# EasyEDA Pro project ProProject_电源电路完整20240517_2024-08-10.epro

# Schematic Schematic24
Create Date: 2024-04-10; Page Name: P1; Project Name: P22; Schematic Name: Schematic24; Update Date: 2024-04-10; Company: 嘉立创EDA; Page Size: A4; Version: V1.0
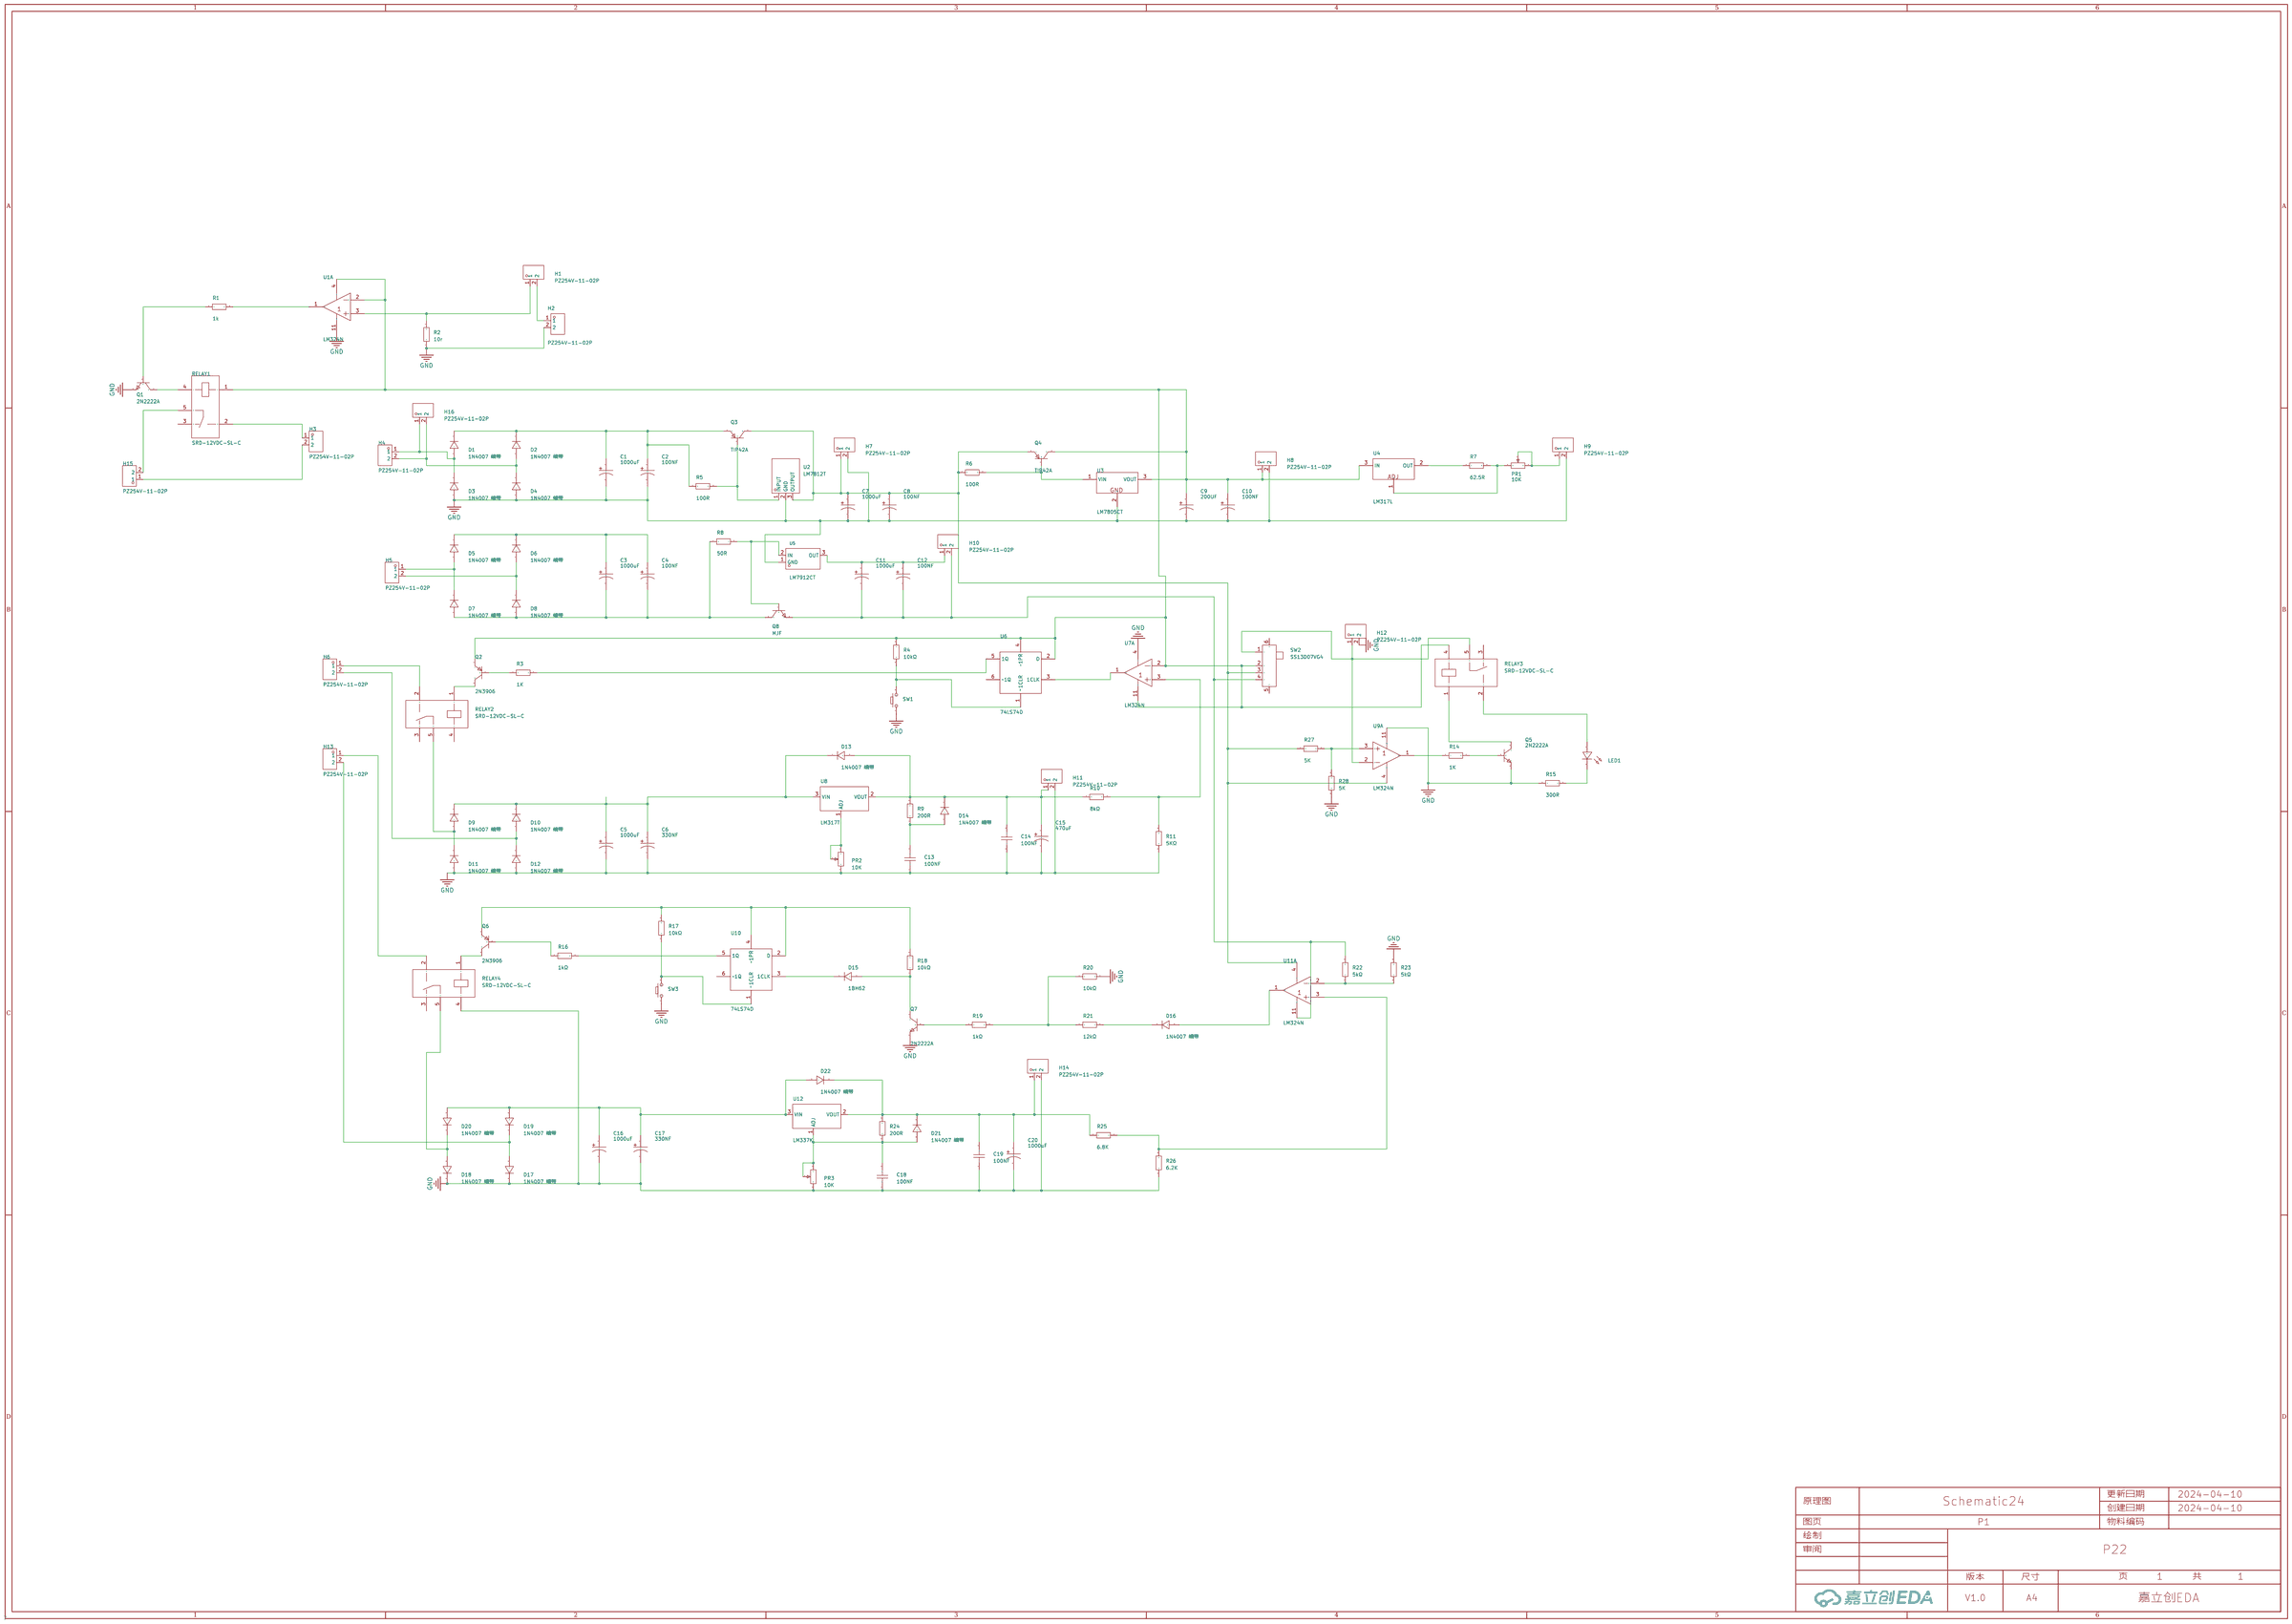
[diagram p0: schematic sheet]

## Parts
C1  1000uF  [CAP-TH_BD12.5-P5.00-D0.6-FD]
C2  100NF  [CAP-TH_BD12.5-P5.00-D0.6-FD]
C3  1000uF  [CAP-TH_BD12.5-P5.00-D0.6-FD]
C4  1000uF  [CAP-TH_BD12.5-P5.00-D0.6-FD]
C5  1000uF  [CAP-TH_BD12.5-P5.00-D0.6-FD]
C6  330NF  [CAP-TH_BD12.5-P5.00-D0.6-FD]
C7  1000uF  [CAP-TH_BD12.5-P5.00-D0.6-FD]
C8  100NF  [CAP-TH_BD12.5-P5.00-D0.6-FD]
C9  200UF  [CAP-TH_BD12.5-P5.00-D0.6-FD]
C10  100NF  [CAP-TH_BD12.5-P5.00-D0.6-FD]
C11  1000uF  [CAP-TH_BD12.5-P5.00-D0.6-FD]
C12  100NF  [CAP-TH_BD12.5-P5.00-D0.6-FD]
C13  100NF  [CAP-TH_L5.5-W4.0-P5.00-D0.5]
C14  100NF  [CAP-TH_L5.5-W4.0-P5.00-D0.5]
C15  470uF  [CAP-TH_BD12.5-P5.00-D0.6-FD]
C16  1000uF  [CAP-TH_BD12.5-P5.00-D0.6-FD]
C17  330NF  [CAP-TH_BD12.5-P5.00-D0.6-FD]
C18  100NF  [CAP-TH_L5.5-W4.0-P5.00-D0.5]
C19  100NF  [CAP-TH_L5.5-W4.0-P5.00-D0.5]
C20  1000uF  [CAP-TH_BD12.5-P5.00-D0.6-FD]
D1  1N4007 编带  [DO-41_BD2.4-L4.7-P8.70-D0.9-RD]
D2  1N4007 编带  [DO-41_BD2.4-L4.7-P8.70-D0.9-RD]
D3  1N4007 编带  [DO-41_BD2.4-L4.7-P8.70-D0.9-RD]
D4  1N4007 编带  [DO-41_BD2.4-L4.7-P8.70-D0.9-RD]
D5  1N4007 编带  [DO-41_BD2.4-L4.7-P8.70-D0.9-RD]
D6  1N4007 编带  [DO-41_BD2.4-L4.7-P8.70-D0.9-RD]
D7  1N4007 编带  [DO-41_BD2.4-L4.7-P8.70-D0.9-RD]
D8  1N4007 编带  [DO-41_BD2.4-L4.7-P8.70-D0.9-RD]
D9  1N4007 编带  [DO-41_BD2.4-L4.7-P8.70-D0.9-RD]
D10  1N4007 编带  [DO-41_BD2.4-L4.7-P8.70-D0.9-RD]
D11  1N4007 编带  [DO-41_BD2.4-L4.7-P8.70-D0.9-RD]
D12  1N4007 编带  [DO-41_BD2.4-L4.7-P8.70-D0.9-RD]
D13  1N4007 编带  [DO-41_BD2.4-L4.7-P8.70-D0.9-RD]
D14  1N4007 编带  [DO-41_BD2.4-L4.7-P8.70-D0.9-RD]
D15  1BH62  [DO-41_BD2.4-L4.7-P8.70-D0.9-RD]
D16  1N4007 编带  [DO-41_BD2.4-L4.7-P8.70-D0.9-RD]
D17  1N4007 编带  [DO-41_BD2.4-L4.7-P8.70-D0.9-RD]
D18  1N4007 编带  [DO-41_BD2.4-L4.7-P8.70-D0.9-RD]
D19  1N4007 编带  [DO-41_BD2.4-L4.7-P8.70-D0.9-RD]
D20  1N4007 编带  [DO-41_BD2.4-L4.7-P8.70-D0.9-RD]
D21  1N4007 编带  [DO-41_BD2.4-L4.7-P8.70-D0.9-RD]
D22  1N4007 编带  [DO-41_BD2.4-L4.7-P8.70-D0.9-RD]
H1  PZ254V-11-02P  [HDR-TH_2P-P2.54-V-M]
H2  PZ254V-11-02P  [HDR-TH_2P-P2.54-V-M]
H3  PZ254V-11-02P  [HDR-TH_2P-P2.54-V-M]
H4  PZ254V-11-02P  [HDR-TH_2P-P2.54-V-M]
H5  PZ254V-11-02P  [HDR-TH_2P-P2.54-V-M]
H6  PZ254V-11-02P  [HDR-TH_2P-P2.54-V-M]
H7  PZ254V-11-02P  [HDR-TH_2P-P2.54-V-M]
H8  PZ254V-11-02P  [HDR-TH_2P-P2.54-V-M]
H9  PZ254V-11-02P  [HDR-TH_2P-P2.54-V-M]
H10  PZ254V-11-02P  [HDR-TH_2P-P2.54-V-M]
H11  PZ254V-11-02P  [HDR-TH_2P-P2.54-V-M]
H12  PZ254V-11-02P  [HDR-TH_2P-P2.54-V-M]
H13  PZ254V-11-02P  [HDR-TH_2P-P2.54-V-M]
H14  PZ254V-11-02P  [HDR-TH_2P-P2.54-V-M]
H15  PZ254V-11-02P  [HDR-TH_2P-P2.54-V-M]
H16  PZ254V-11-02P  [HDR-TH_2P-P2.54-V-M]
LED1  -  [LED_TH-3mm]
PR1  10K  [R_3386P]
PR2  10K  [R_3386P]
PR3  10K  [R_3386P]
Q1  2N2222A  [TO-92-3_L4.8-W3.7-P2.54-R]
Q2  2N3906  [TO-92-3_L4.9-W3.7-P1.27-L]
Q3  TIP42A  [TO-220-3_L10.2-W4.5-P2.54-L]
Q4  TIP42A  [TO-220-3_L10.2-W4.5-P2.54-L]
Q5  2N2222A  [TO-92-3_L4.8-W3.7-P2.54-R]
Q6  2N3906  [TO-92-3_L4.9-W3.7-P1.27-L]
Q7  2N2222A  [TO-92-3_L4.8-W3.7-P2.54-R]
Q8  MJF  [TO-92-3_L4.8-W3.7-P2.54-R]
R1  1k  [Res_1/8W]
R2  10r  [Res_1/8W]
R3  1K  [Res_1/8W]
R4  10kΩ  [Res_1/8W]
R5  100R  [Res_1/8W]
R6  100R  [Res_1/8W]
R7  62.5R  [Res_1/8W]
R8  50R  [Res_1/8W]
R9  200R  [Res_1/8W]
R10  8kΩ  [Res_1/8W]
R11  5KΩ  [Res_1/8W]
R14  1K  [Res_1/8W]
R15  300R  [Res_1/8W]
R16  1kΩ  [Res_1/8W]
R17  10kΩ  [Res_1/8W]
R18  10kΩ  [Res_1/8W]
R19  1kΩ  [Res_1/8W]
R20  10kΩ  [Res_1/8W]
R21  12kΩ  [Res_1/8W]
R22  5kΩ  [Res_1/8W]
R23  5kΩ  [Res_1/8W]
R24  200R  [Res_1/8W]
R25  6.8K  [Res_1/8W]
R26  6.2K  [Res_1/8W]
R27  5K  [Res_1/8W]
R28  5K  [Res_1/8W]
RELAY1  SRD-12VDC-SL-C  [RELAY-TH_SRD-XXVDC-XL-C]
RELAY2  SRD-12VDC-SL-C  [RELAY-TH_SRD-XXVDC-XL-C]
RELAY3  SRD-12VDC-SL-C  [RELAY-TH_SRD-XXVDC-XL-C]
RELAY4  SRD-12VDC-SL-C  [RELAY-TH_SRD-XXVDC-XL-C]
SW1  -  [Key_TH_3.5x6x4.3]
SW2  SS13D07VG4  [SW-TH_SS13D07VG4]
SW3  -  [Key_TH_3.5x6x4.3]
U1  LM324N  [DIP-14_L19.4-W6.4-P2.54-LS7.6-BL]  (section 1)
U2  LM7812T  [TO-220-3_L10.0-W4.5-P2.54-L]
U3  LM7805CT  [TO-220-3_L10.2-W4.6-P2.54-L]
U4  LM317L  [TO-92-3_L4.9-W3.7-P1.27-L]
U5  LM7912CT  [TO-220-3_L10.0-W4.6-P2.54-L]
U6  74LS74D  [74LS74]
U7  LM324N  [DIP-14_L19.4-W6.4-P2.54-LS7.6-BL]  (section 1)
U8  LM317T  [TO-220-3_L10.0-W4.6-P2.54-L]
U9  LM324N  [DIP-14_L19.4-W6.4-P2.54-LS7.6-BL]  (section 1)
U10  74LS74D  [74LS74]
U11  LM324N  [DIP-14_L19.4-W6.4-P2.54-LS7.6-BL]  (section 1)
U12  LM337K  [TO-220-3_L10.0-W4.6-P2.54-L]

## Library data of the parts
C1-C12 C15-C17 C20 = ECLJ1321102M035P00: 容值:1000uF;精度:±20%;额定电压:35V;; LCSC Part Name: 1000uF ±20% 35V; Supplier Part: C156894; Manufacturer: TOPAZ(黄宝石); Supplier Footprint: 插件; JLCPCB Part Class: 扩展库; Datasheet: https://atta.szlcsc.com/upload/public/pdf/source/20200529/C156894_EF4CA6A97A577F5C9E78FC7D4823CADE.pdf; Supplier: LCSC; Tolerance: ±20%; Rated Voltage: 35V; Lead Spacing: 5mm; Lifetime @ Temp: 10000hrs@105℃
C13 C14 C18 C19 = Y5P102K2KV16CC0224: 容值:1nF;精度:±10%;额定电压:2kV;温度系数:SL;; LCSC Part Name: 1nF ±10% 2kV; Supplier Part: C2887266; Manufacturer: KNSCHA(科尼盛); Supplier Footprint: 插件,P=5mm; JLCPCB Part Class: 扩展库; Datasheet: https://atta.szlcsc.com/upload/public/pdf/source/20210824/9DB7111BBFCE5397BE2F54950262B877.pdf; Supplier: LCSC; Tolerance: ±10%; Voltage Rated: 2kV; Lead Spacing: 5mm; Temperature Coefficient: SL
D1-D22 = 1N4007 编带: 二极管配置:-;正向压降(Vf):1.1V@1A;直流反向耐压(Vr):1kV;平均整流电流(Io):1A;; LCSC Part Name: 电压:1kV 电流:1A; Supplier Part: C19357; Manufacturer: MDD; Supplier Footprint: DO-41; JLCPCB Part Class: 扩展库; Datasheet: https://atta.szlcsc.com/upload/public/pdf/source/20230823/8ED6F4D197D9D1C3236A032CC6FF7CF4.pdf; Supplier: LCSC; Forward Voltage (Vf@If): 1.1V@1A; Reverse Voltage (Vr): 1kV; Average Rectified Current (Io): 1A; Reverse Leakage Current: 5uA@1kV
H1-H16 = PZ254V-11-02P: 插针结构:1x2P;间距:2.54mm;行距:-;圆针/方针:方针;安装类型:直插;排数:单排;总PIN位数:2P;额定电流:-;额定电压:-;配合针长度:6mm;塑高:2.5mm;端接针长度:3mm;触头材质:黄铜;触头镀层:-;工作温度范围:-40℃~+105℃;颜色:黑色;; LCSC Part Name: 间距:2.54mm 1x2P 直插 方针; Supplier Part: C492401; Manufacturer: XFCN(兴飞); Supplier Footprint: 插件,P=2.54mm; JLCPCB Part Class: 扩展库; Datasheet: https://atta.szlcsc.com/upload/public/pdf/source/20200309/C492401_A812433581A9B211A7FFA413ADDFF0E5.pdf; Supplier: LCSC; Pin Structure: 1x2P; Pitch: 2.54mm; Circluar Pins/Square Pins: 方针; Mounting Type: 直插; Number of Rows: 单排; Number of Pins: 2P; Length of Mating Pin: 6mm; Insulation Height: 2.5mm; Length of End Connection Pin: 3mm; Contact Material: 黄铜; Operating Temperature Range: -40℃~+105℃; Color: 黑色
LED1 = LED_TH-R_3mm: Supplier Footprint: 插件
PR1-PR3 = R_3386P: Supplier Footprint: 直插
Q1 Q5 Q7 Q8 = 2N2222A_C358533: 晶体管类型:NPN;集电极电流(Ic):600mA;集射极击穿电压(Vceo):40V;功率(Pd):625mW;直流电流增益(hFE@Ic,Vce):100@150mA,10V;; LCSC Part Name: NPN 电流:600mA 耐压:40V (100-300); Supplier Part: C358533; Manufacturer: BLUE ROCKET(蓝箭); Supplier Footprint: TO-92-3; JLCPCB Part Class: 扩展库; Datasheet: https://atta.szlcsc.com/upload/public/pdf/source/20190129/C358533_AFAFE39542E316DF9E781A186BBE98F7.pdf; Supplier: LCSC; Transistor Type: NPN; Collector Current (Ic): 600mA; Collector-Emitter Breakdown Voltage (Vceo): 40V; Power Dissipation (Pd): 625mW; DC Current Gain (hFE@Ic,Vce): 100@150mA,10V; Transition Frequency (fT): 300MHz; Collector Cut-Off Current (Icbo): 100nA; Collector-Emitter Saturation Voltage (VCE(sat)@Ic,Ib): 600mV@500mA,50mA
Q2 Q6 = 2N3906_C2874603: 晶体管类型:PNP;集电极电流(Ic):200mA;集射极击穿电压(Vceo):40V;功率(Pd):625mW;直流电流增益(hFE@Ic,Vce):100@10mA,1V;; LCSC Part Name: PNP 电流:200mA 耐压:40V; Supplier Part: C2874603; Manufacturer: JSMSEMI(杰盛微); Supplier Footprint: TO-92-3; JLCPCB Part Class: 扩展库; Datasheet: https://atta.szlcsc.com/upload/public/pdf/source/20240105/6AF80AF3631C4F4FC467A6C2E9DB1BB5.pdf; Supplier: LCSC; Transistor Type: PNP; Collector Current (Ic): 200mA; Collector-Emitter Breakdown Voltage (Vceo): 40V; Power Dissipation (Pd): 625mW; DC Current Gain (hFE@Ic,Vce): 100@10mA,1V; Transition Frequency (fT): 250MHz; Collector Cut-Off Current (Icbo): 100nA; Collector-Emitter Saturation Voltage (VCE(sat)@Ic,Ib): 400mV@50mA,5mA
Q3 Q4 = TIP42A: 晶体管类型:PNP;集电极电流(Ic):6A;集射极击穿电压(Vceo):60V;功率(Pd):2W;直流电流增益(hFE@Ic,Vce):15@3A,4V;; LCSC Part Name: PNP 电流:6A 耐压:60V; Supplier Part: C2935191; Manufacturer: ST(意法半导体); Supplier Footprint: TO-220; JLCPCB Part Class: 扩展库; Datasheet: https://atta.szlcsc.com/upload/public/pdf/source/20211229/3E40274170D81FEBDA06B7400E6B1E18.pdf; Supplier: LCSC; Transistor Type: PNP; Collector Current (Ic): 6A; Collector-Emitter Breakdown Voltage (Vceo): 60V; Power Dissipation (Pd): 2W; DC Current Gain (hFE@Ic,Vce): 15@3A,4V; Collector Cut-Off Current (Icbo): 700uA; Collector-Emitter Saturation Voltage (VCE(sat)@Ic,Ib): 1.5V@6A,600mA
R1-R11 R14-R28 = Res_AXIAL-1/8W: Supplier Footprint: 轴向引线
RELAY1-RELAY4 = SRD-12VDC-SL-C: 线圈电压:12V;触点形式:一组转换:1C(单刀双掷-转换);触点容量(电阻负载):-;最大切换电压:250V@AC;最大切换电流:15A;; Supplier Part: C30431; Manufacturer: 松乐; Supplier Footprint: 插件,15.6x19.2mm; JLCPCB Part Class: 扩展库; Datasheet: https://atta.szlcsc.com/upload/public/pdf/source/20200305/C490149_C96E4098A3B1FFB377D5AD2E40B7C2A8.pdf; Supplier: LCSC; Coil Voltage: 12V; Contact Form: 一组转换:1C(单刀双掷-转换); Pin Number: 5; Maximum Switching Voltage: 250V@AC; Coil Rated Power: 360mW; Maximum Switching Current: 15A; Coil Type: 无极性-单线圈; Coil Resistance: 400Ω; Contact Resistance: 100mΩ; Operate Time: 10ms; Release Time: 10ms
SW1 SW3 = Key_TH_3.5x6x4.3: Supplier Footprint: 插件
SW2 = SS13D07VG4: 电路结构:单刀三掷;安装方式:直插;开关颜色:-;额定电流(DC):500mA;额定电压(DC):50V;额定电流(AC):-;额定电压(AC):-;机械寿命:5千次;; LCSC Part Name: 4脚3三档位SS13D07VG2 1P3T立式拨动开关,柄长4MM; Supplier Part: C2681578; Manufacturer: SHOU HAN(首韩); Supplier Footprint: 插件; JLCPCB Part Class: 扩展库; Datasheet: https://atta.szlcsc.com/upload/public/pdf/source/20210224/C2681578_7484B27E9707CF71917AD7FACB0D77B9.pdf; Supplier: LCSC; Circuit: 单刀三掷; Pin Style: PC引脚; Switch Length: 12.8mm; Switch Width: 4.4mm; Switch Height: 4.7mm; Mounting Style: 直插; Current Rating (DC): 500mA; Voltage Rating (DC): 50V; Mechanical Life: 5千次; Operating Temperature: -10℃~+50℃
U1 U7 U9 U11 = LM324N_C725320: 放大器数:-;; LCSC Part Name: 四路运算放大器; Supplier Part: C725320; Manufacturer: HGSEMI(华冠); Supplier Footprint: DIP-14; JLCPCB Part Class: Extended Part; Datasheet: https://atta.szlcsc.com/upload/public/pdf/source/20200820/C725320_F412C3792749730AA8E5D3FBC02E9B6A.pdf; Supplier: LCSC
U2 = LM7812T: Supplier Part: C2902509; Manufacturer: HGSEMI(华冠); Supplier Footprint: TO-220; JLCPCB Part Class: 扩展库; Datasheet: https://atta.szlcsc.com/upload/public/pdf/source/20211025/81B2DEEFFF7C2ADEC3E836E1284744FB.pdf; Supplier: LCSC
U3 = LM7805CT_C5444281: 输出类型:固定;最大输入电压:35V;输出电压:5V;最大输出电流:1.5A;输出极性:正极;; Supplier Part: C5444281; Manufacturer: Siproin(上海矽朋); Supplier Footprint: TO-220; JLCPCB Part Class: 扩展库; Datasheet: https://atta.szlcsc.com/upload/public/pdf/source/20231211/F0B890ADA39C728569627B2D8D7BD9A3.pdf; Supplier: LCSC; Output Type: 固定; Maximum Input Voltage: 35V; Output Voltage: 5V; MAX Output Current: 1.5A; standby current: 2mA; Output Polarity: 正极; Number of Outputs: 1
U4 = LM317L: 输出类型:可调;最大输入电压:40V;输出电压:1.2V~37V;最大输出电流:100mA;输出极性:正极;; LCSC Part Name: ADJ 输入40V 输出1.2V~37V 100mA; Supplier Part: C126053; Manufacturer: HTC; Supplier Footprint: TO-92-3; JLCPCB Part Class: 扩展库; Datasheet: https://atta.szlcsc.com/upload/public/pdf/source/20170814/C126053_1502678388802885925.pdf; Supplier: LCSC; Output Type: 可调; Maximum Input Voltage: 40V; Output Voltage: 1.2V~37V; MAX Output Current: 100mA; Dropout Voltage: 5V@(40mA); Output Polarity: 正极; Number of Outputs: 1
U5 = LM7912CT_C7432211: 线性稳压器(LDO) 1.5A版本; Supplier Part: C7432211; Manufacturer: HGSEMI(华冠); Supplier Footprint: TO-220-3; Supplier: LCSC
U6 U10 = 74LS74D
U8 = LM317T_C5444279: 输出类型:可调;最大输入电压:40V;输出电压:1.7V~37V;最大输出电流:1.5A;输出极性:正极;; Supplier Part: C5444279; Manufacturer: Siproin(上海矽朋); Supplier Footprint: TO-220; JLCPCB Part Class: Extended Part; Datasheet: https://atta.szlcsc.com/upload/public/pdf/source/20230412/703E44E72FEA4765420A69E1CD3AD9D7.pdf; Supplier: LCSC; Output Type: 可调; Maximum Input Voltage: 40V; Output Voltage: 1.7V~37V; MAX Output Current: 1.5A; Output Polarity: 正极; Number of Outputs: 1
U12 = LM317T_C5444279: 输出类型:可调;最大输入电压:40V;输出电压:1.7V~37V;最大输出电流:1.5A;输出极性:正极;; LCSC Part Name: LM317T; Supplier Part: C5444279; Manufacturer: Siproin(上海矽朋); Supplier Footprint: TO-220; JLCPCB Part Class: Extended Part; Datasheet: https://atta.szlcsc.com/upload/public/pdf/source/20230412/703E44E72FEA4765420A69E1CD3AD9D7.pdf; Supplier: LCSC; Output Type: 可调; Maximum Input Voltage: 40V; Output Voltage: 1.7V~37V; MAX Output Current: 1.5A; Output Polarity: 正极; Number of Outputs: 1

## Nets
GND: C1.2 C2.2 C5.2 C6.2 C7.2 C8.2 C9.2 C10.2 C13.1 C14.1 C15.2 C16.2 C17.2 C18.1 C19.1 C20.2 D3.2(A) D4.2(A) D11.2(A) D12.2(A) D17.1(K) D18.1(K) H2.2 H7.2 H8.2 H9.2 H11.2 H12.2 H14.2 PR2.3 PR3.3 Q1.3(E) Q5.3(E) Q7.3(E) R2.1 R11.1 R15.1 R20.2 R23.2 R26.1 R28.1 RELAY4.4 SW1.A SW3.A U1.11(GND) U2.2(GND) U3.2(GND) U5.1(GND) U7.4(VCC) U9.11(GND)
$1N8527: Q1.2(B) R1.1
$1N8531: R1.2 U1.1(OUT1)
$1N8534: Q1.1(C) RELAY1.4
$1N8562: H1.1 R2.2 U1.3(IN1+)
$1N8572: H1.2 H2.1
$1N8662: H15.2 RELAY1.5
$1N8666: H3.2 H15.1
$1N8670: H3.1 RELAY1.2
$1N8706: Q4.1(B) R6.2 U3.1(VIN)
$1N8820: D1.2(A) D3.1(K) H4.1 H16.1
$1N8830: D2.2(A) D4.1(K) H4.2 H16.2
$1N8864: C1.1 C2.1 D1.1(K) D2.1(K) Q3.3(E) R5.1
$1N8887: Q3.1(B) R5.2 U2.1(INPUT)
$1N9273: R7.1 U4.2(OUT)
$1N9281: PR1.3 R7.2 U4.1(ADJ)
$1N9296: H9.1 PR1.1 PR1.2
$1N9332: D5.2(A) D7.1(K) H5.1
$1N9341: D6.2(A) D8.1(K) H5.2
$1N9352: C3.1 C4.1 D5.1(K) D6.1(K)
$1N9450: Q8.2(B) R8.2 U5.2(IN)
$1N9461: C3.2 C4.2 D7.2(A) D8.2(A) Q8.1(C) R8.1
$1N9538: H6.1 RELAY2.2
$1N9559: D9.2(A) D11.1(K) RELAY2.5
$1N9564: D10.2(A) D12.1(K) H6.2
$1N9660: C5.1 C6.1 D9.1(K) D10.1(K) D13.1(K) U8.3(VIN)
$1N9701: PR2.1 PR2.2 U8.1(ADJ)
$1N9726: C13.2 D14.2(A) R9.1
$1N9822: C14.2 C15.1 D13.2(A) D14.1(K) H11.1 R9.2 R10.1 U8.2(VOUT)
$1N9845: Q2.3(C) RELAY2.1
$1N9860: Q2.2(B) R3.1
$1N9863: R3.2 U6.5(1Q)
$1N9870: R4.1 SW1.B U6.1(～1CLR)
$1N9927: U6.3(1CLK) U7.1(OUT1)
$1N10006: R10.2 R11.2 U7.3(IN1+)
$1N10325: R22.1 R23.1 U11.2(IN1-)
$1N10603: R27.2 R28.2 U9.3(IN1+)
$1N10668: H12.1 RELAY3.5 SW2.1 U9.2(IN1-)
$1N10682: LED1.1(C) RELAY3.2
$1N10687: Q5.1(C) RELAY3.1
$1N10691: Q5.2(B) R14.2
$1N10694: R14.1 U9.1(OUT1)
$1N10806: C7.1 C8.1 H7.1 Q3.2(C) Q4.3(E) R6.1 R27.1 SW2.3 U2.3(OUTPUT) U9.4(VCC) U11.4(VCC)
$1N10899: LED1.2(A) R15.2
$1N10928: H13.1 RELAY4.2
$1N10938: D17.2(A) D19.1(K) H13.2
$1N10984: Q6.3(C) RELAY4.1
$1N11025: Q6.2(B) R16.1
$1N11032: R16.2 U10.5(1Q)
$1N11038: R17.1 SW3.B U10.1(～1CLR)
$1N11076: D15.1(K) U10.3(1CLK)
$1N11079: Q6.1(E) R17.2 R18.2 U10.2(D) U10.4(~1PR)
$1N11096: D15.2(A) Q7.1(C) R18.1
$1N11127: Q7.2(B) R19.1
$1N11133: R19.2 R20.1 R21.1
$1N11145: D16.1(K) R21.2
$1N11175: D16.2(A) U11.1(OUT1)
$1N11189: R25.2 R26.2 U11.3(IN1+)
$1N11389: D18.2(A) D20.1(K) RELAY4.5
$1N11436: C16.1 C17.1 D19.2(A) D20.2(A) D22.2(A) U12.3(VIN)
$1N11615: C19.2 C20.1 D21.1(K) D22.1(K) H14.1 R24.2 R25.1 U12.2(VOUT)
$1N11653: C18.2 D21.2(A) PR3.1 PR3.2 R24.1 U12.1(ADJ)
$1N11660: C11.2 C12.2 H10.2 Q8.3(E) R22.2 SW2.4 U11.11(GND)
$1N11678: C11.1 C12.1 H10.1 U5.3(OUT)
$1N11708: C9.1 C10.1 H8.1 Q2.1(E) Q4.2(C) R4.2 RELAY1.1 RELAY3.4 SW2.2 U1.2(IN1-) U1.4(VCC) U3.3(VOUT) U4.3(IN) U6.2(D) U6.4(~1PR) U7.2(IN1-) U7.11(GND)

Not connected (* = marked no-connect by the designer): RELAY1 3; RELAY2 3 4; RELAY3 3; RELAY4 3; SW2 5 6; U6 6(~1Q); U10 6(~1Q)

# Board PCB39
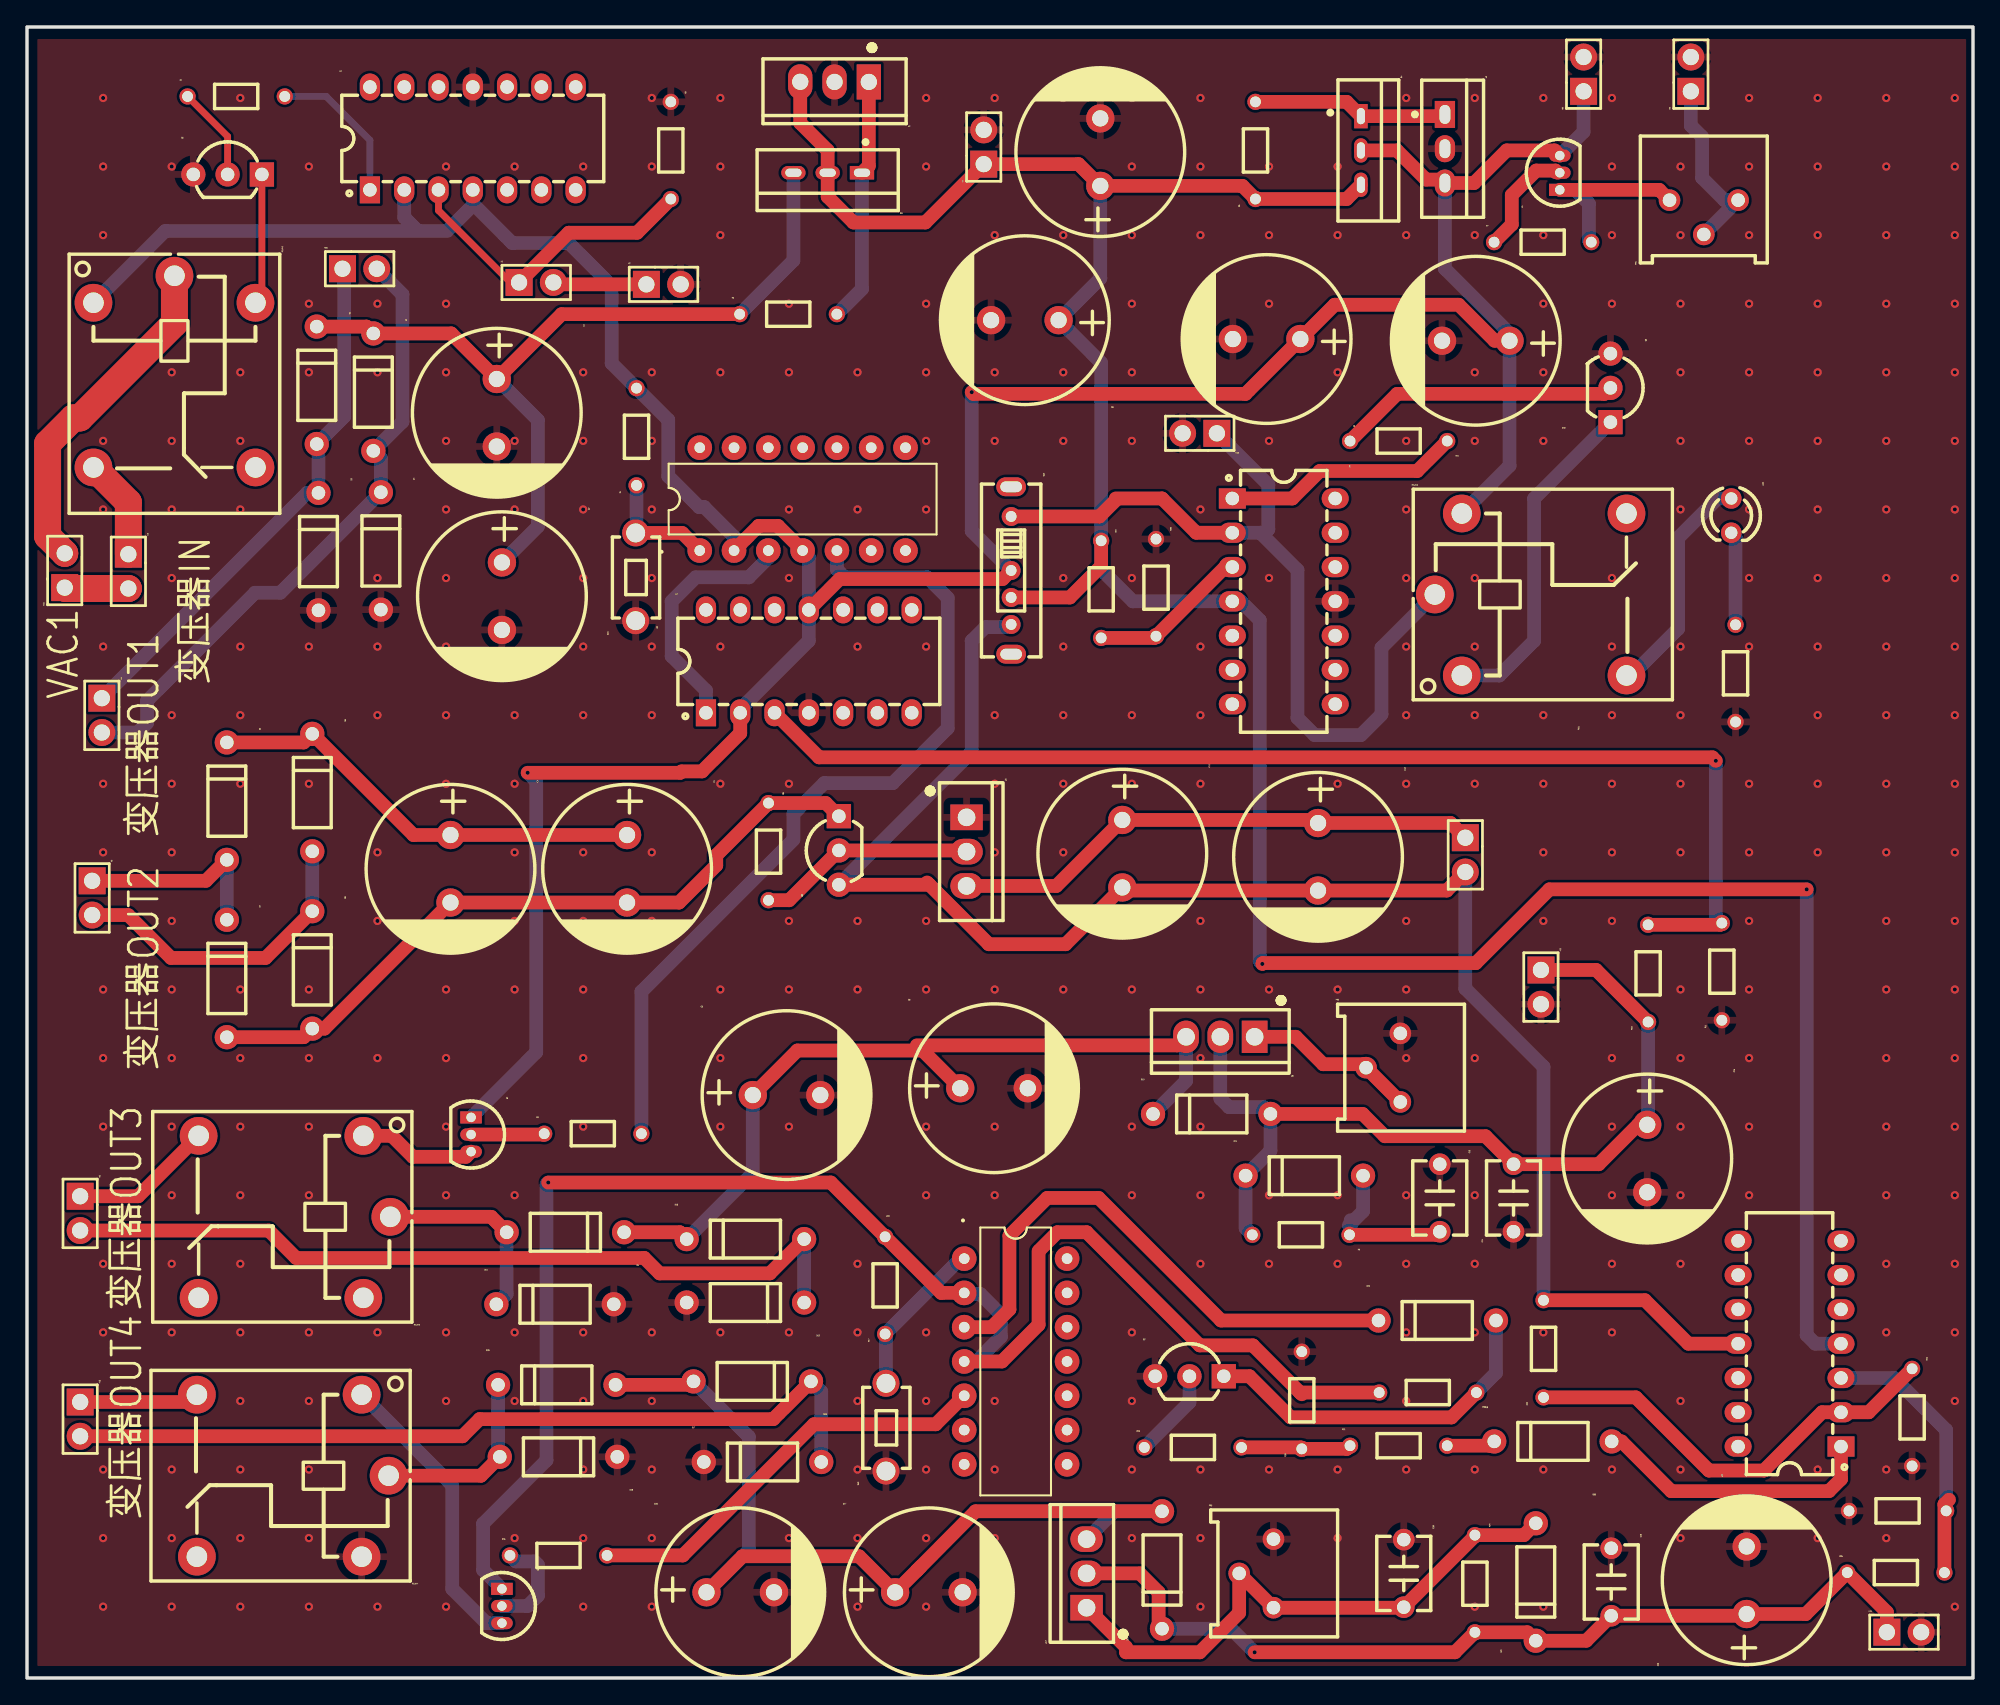
[diagram p1: board, top side]
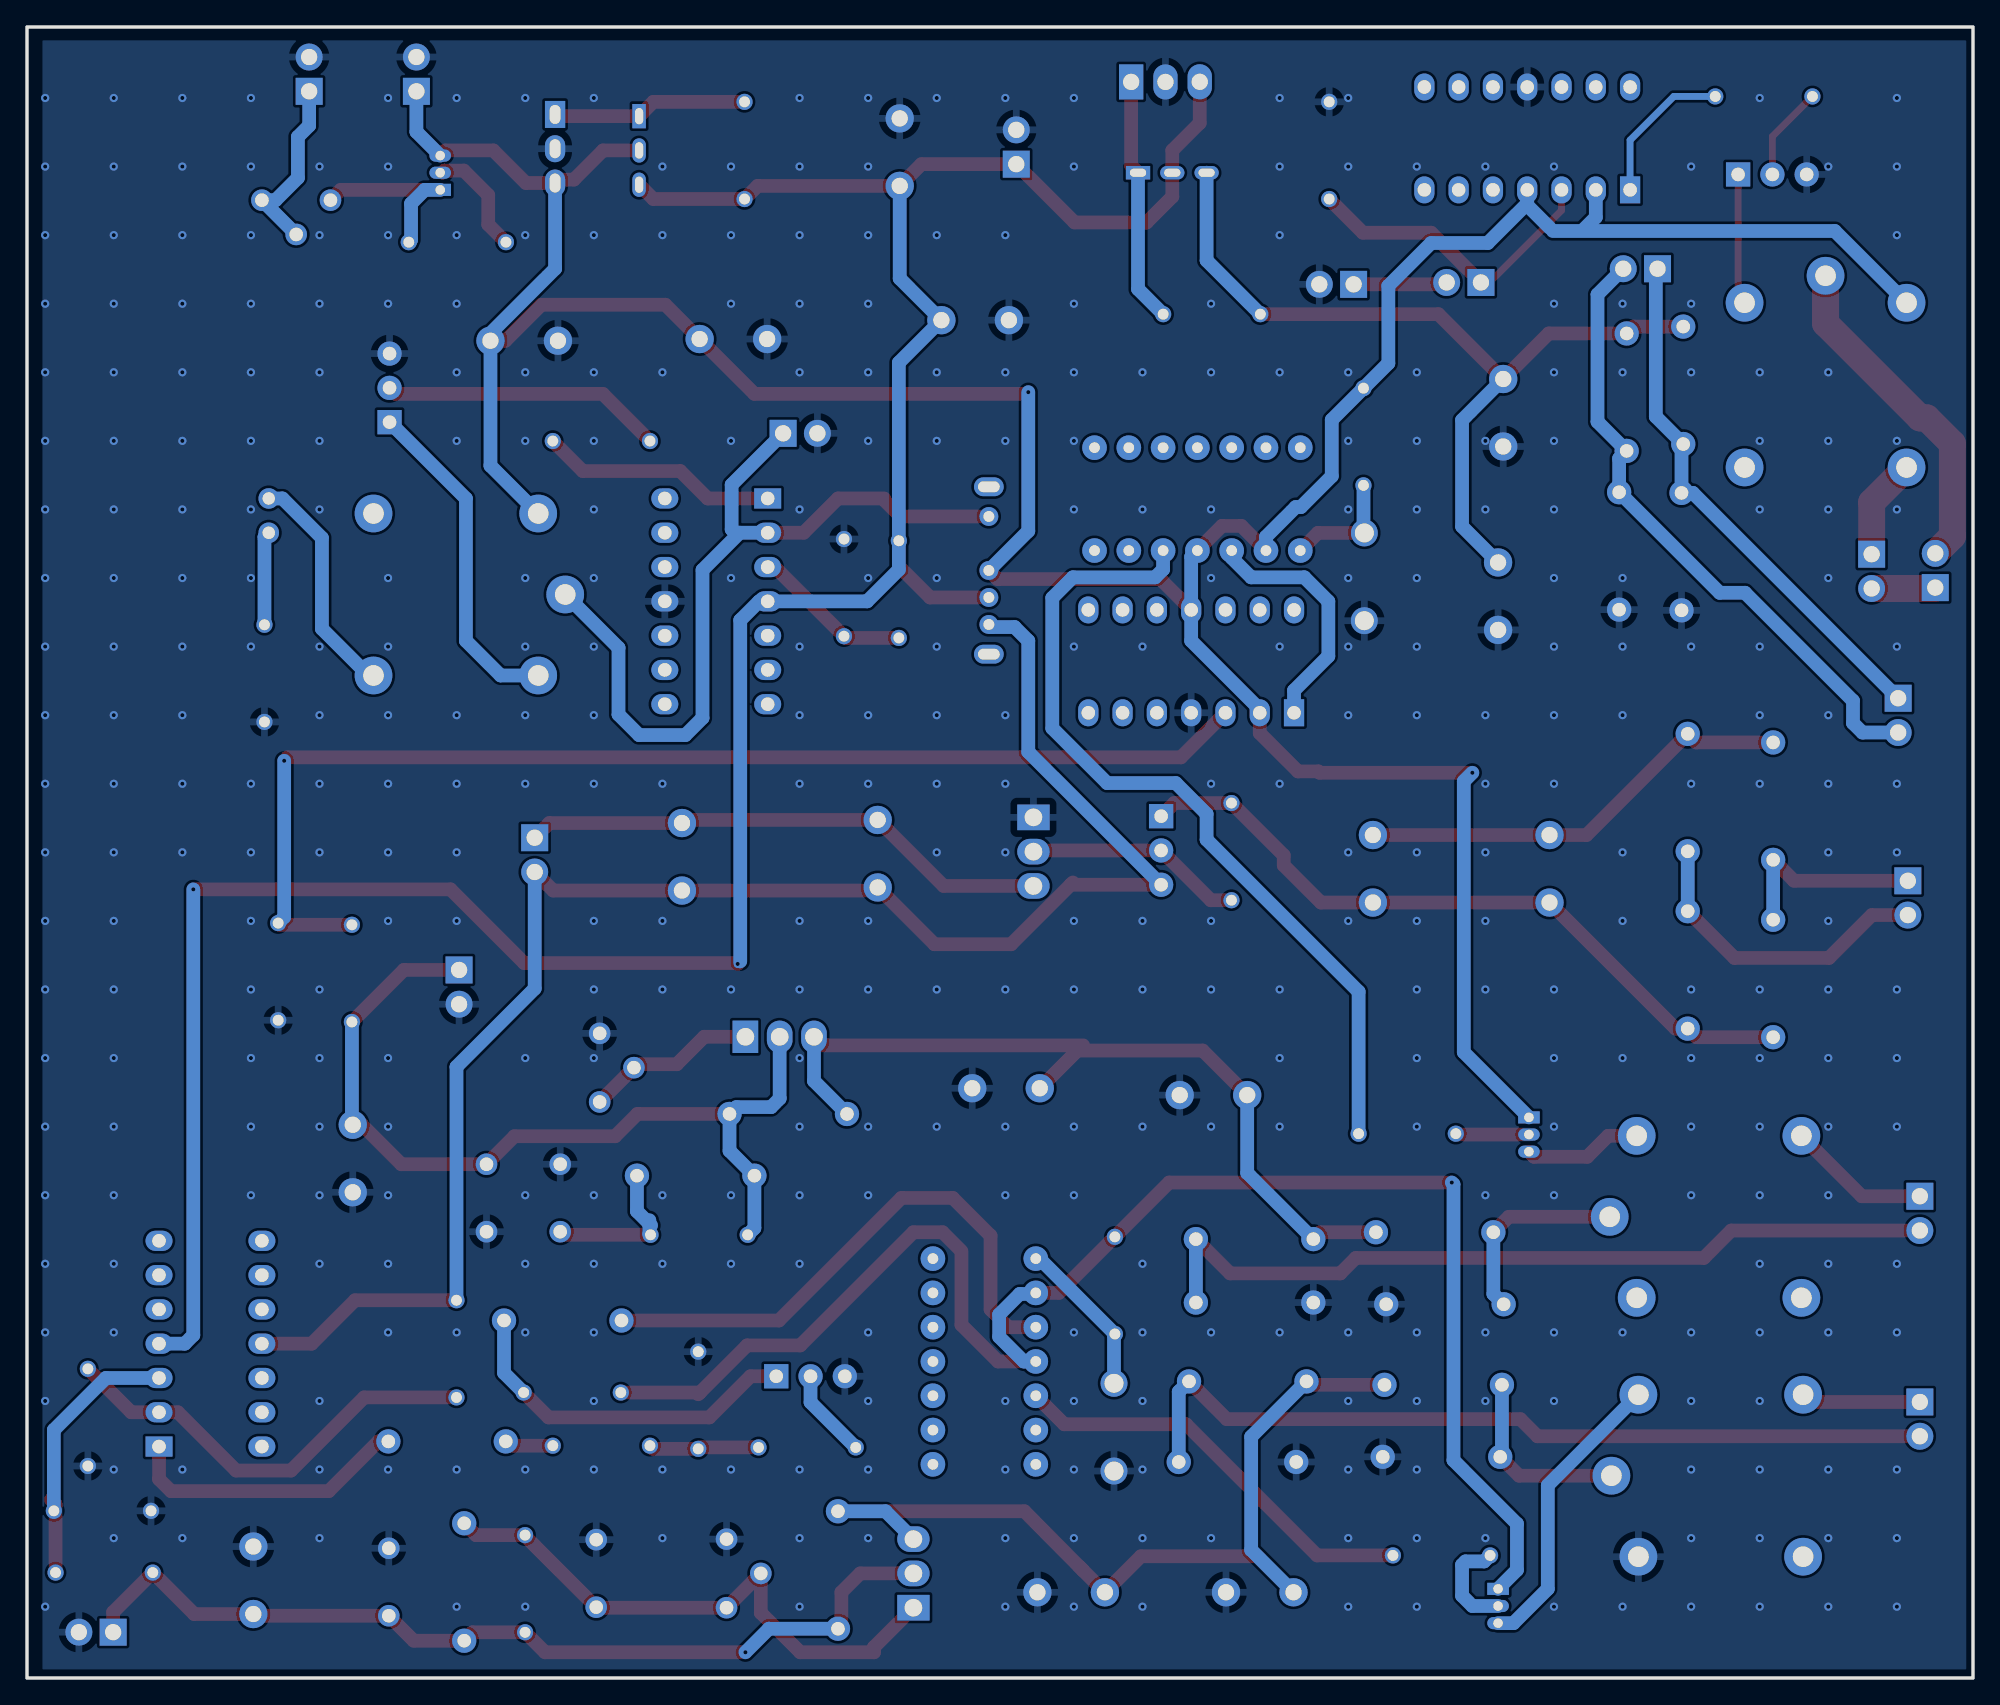
[diagram p2: board, bottom side, seen from below]

Outline 144.14 x 122.3 mm; copper layers: Top Layer, Bottom Layer. Coordinates in mm from the lower left corner of the outline.
Outline path: rectangle 0,122.3 144.14,0
Stack: Top Layer 0.035mm / Dielectric1 1.51mm FR4 er 4.5 / Bottom Layer 0.035mm

## Design rules (mm)
template: JLCPCB Capability(Two Layers Board)
spacing copperThickness1oz (default): track to track 0.102, other pairs 0.152 to 0.3
spacing copperThickness2oz: track to track 0.203, other pairs 0.152 to 0.3
track width copperThickness1oz (default): min 0.127, default 0.254, max 2.54
track width copperThickness2oz: min 0.203, default 0.254, max 2.54
differential pair differentialPair (default): width min 0.127, default 0.254, max 2.54; gap min 0.152, default 0.152
via viaSize (default): diameter min 0.5, default 0.61, max 10; hole min 0.3, default 0.305, max 6.3
pour e1312 uses copperRegion

## Placement (name value [footprint] x y rotation side)
C1  1000uF  [CAP-TH_BD12.5-P5.00-D0.6-FD]  34.8 93.73 270 top
C2  100NF  [CAP-TH_BD12.5-P5.00-D0.6-FD]  35.18 80.14 270 top
C3  1000uF  [CAP-TH_BD12.5-P5.00-D0.6-FD]  31.37 59.94 270 top
C4  1000uF  [CAP-TH_BD12.5-P5.00-D0.6-FD]  44.45 59.94 270 top
C5  1000uF  [CAP-TH_BD12.5-P5.00-D0.6-FD]  56.26 43.18 0 top
C6  330NF  [CAP-TH_BD12.5-P5.00-D0.6-FD]  71.63 43.69 0 top
C7  1000uF  [CAP-TH_BD12.5-P5.00-D0.6-FD]  79.5 113.03 90 top
C8  100NF  [CAP-TH_BD12.5-P5.00-D0.6-FD]  73.91 100.58 180 top
C9  200UF  [CAP-TH_BD12.5-P5.00-D0.6-FD]  91.82 99.19 180 top
C10  100NF  [CAP-TH_BD12.5-P5.00-D0.6-FD]  107.32 99.06 180 top
C11  1000uF  [CAP-TH_BD12.5-P5.00-D0.6-FD]  81.13 61.06 270 top
C12  100NF  [CAP-TH_BD12.5-P5.00-D0.6-FD]  95.63 60.83 270 top
C13  100NF  [CAP-TH_L5.5-W4.0-P5.00-D0.5]  104.65 35.56 270 top
C14  100NF  [CAP-TH_L5.5-W4.0-P5.00-D0.5]  110.11 35.56 90 top
C15  470uF  [CAP-TH_BD12.5-P5.00-D0.6-FD]  120.02 38.48 270 top
C16  1000uF  [CAP-TH_BD12.5-P5.00-D0.6-FD]  52.83 6.35 0 top
C17  330NF  [CAP-TH_BD12.5-P5.00-D0.6-FD]  66.8 6.35 0 top
C18  100NF  [CAP-TH_L5.5-W4.0-P5.00-D0.5]  101.98 7.75 270 top
C19  100NF  [CAP-TH_L5.5-W4.0-P5.00-D0.5]  117.35 7.11 270 top
C20  1000uF  [CAP-TH_BD12.5-P5.00-D0.6-FD]  127.38 7.24 90 top
D1  1N4007 编带  [DO-41_BD2.4-L4.7-P8.70-D0.9-RD]  21.46 95.76 270 top
D2  1N4007 编带  [DO-41_BD2.4-L4.7-P8.70-D0.9-RD]  25.65 95.25 270 top
D3  1N4007 编带  [DO-41_BD2.4-L4.7-P8.70-D0.9-RD]  21.59 83.44 270 top
D4  1N4007 编带  [DO-41_BD2.4-L4.7-P8.70-D0.9-RD]  26.21 83.49 270 top
D5  1N4007 编带  [DO-41_BD2.4-L4.7-P8.70-D0.9-RD]  14.8 64.95 270 top
D6  1N4007 编带  [DO-41_BD2.4-L4.7-P8.70-D0.9-RD]  21.13 65.59 270 top
D7  1N4007 编带  [DO-41_BD2.4-L4.7-P8.70-D0.9-RD]  14.8 51.82 270 top
D8  1N4007 编带  [DO-41_BD2.4-L4.7-P8.70-D0.9-RD]  21.13 52.45 270 top
D9  1N4007 编带  [DO-41_BD2.4-L4.7-P8.70-D0.9-RD]  39.88 33.02 180 top
D10  1N4007 编带  [DO-41_BD2.4-L4.7-P8.70-D0.9-RD]  53.21 32.51 0 top
D11  1N4007 编带  [DO-41_BD2.4-L4.7-P8.70-D0.9-RD]  39.12 27.69 0 top
D12  1N4007 编带  [DO-41_BD2.4-L4.7-P8.70-D0.9-RD]  53.21 27.81 180 top
D13  1N4007 编带  [DO-41_BD2.4-L4.7-P8.70-D0.9-RD]  87.76 41.78 0 top
D14  1N4007 编带  [DO-41_BD2.4-L4.7-P8.70-D0.9-RD]  94.61 37.21 0 top
D15  1BH62  [DO-41_BD2.4-L4.7-P8.70-D0.9-RD]  104.46 26.48 0 top
D16  1N4007 编带  [DO-41_BD2.4-L4.7-P8.70-D0.9-RD]  113.03 17.53 0 top
D17  1N4007 编带  [DO-41_BD2.4-L4.7-P8.70-D0.9-RD]  54.48 16 0 top
D18  1N4007 编带  [DO-41_BD2.4-L4.7-P8.70-D0.9-RD]  39.37 16.38 180 top
D19  1N4007 编带  [DO-41_BD2.4-L4.7-P8.70-D0.9-RD]  53.72 21.97 180 top
D20  1N4007 编带  [DO-41_BD2.4-L4.7-P8.70-D0.9-RD]  39.24 21.72 0 top
D21  1N4007 编带  [DO-41_BD2.4-L4.7-P8.70-D0.9-RD]  111.76 7.11 90 top
D22  1N4007 编带  [DO-41_BD2.4-L4.7-P8.70-D0.9-RD]  84.07 8 90 top
H1  PZ254V-11-02P  [HDR-TH_2P-P2.54-V-M]  37.72 103.38 0 top
H2  PZ254V-11-02P  [HDR-TH_2P-P2.54-V-M]  47.15 103.24 0 top
H3  PZ254V-11-02P  [HDR-TH_2P-P2.54-V-M]  7.51 81.98 270 top
H4  PZ254V-11-02P  [HDR-TH_2P-P2.54-V-M]  5.54 71.31 270 top
H5  PZ254V-11-02P  [HDR-TH_2P-P2.54-V-M]  4.83 57.78 270 top
H6  PZ254V-11-02P  [HDR-TH_2P-P2.54-V-M]  3.94 34.42 270 top
H7  PZ254V-11-02P  [HDR-TH_2P-P2.54-V-M]  70.87 113.41 90 top
H8  PZ254V-11-02P  [HDR-TH_2P-P2.54-V-M]  115.3 118.81 90 top
H9  PZ254V-11-02P  [HDR-TH_2P-P2.54-V-M]  123.25 118.81 90 top
H10  PZ254V-11-02P  [HDR-TH_2P-P2.54-V-M]  106.54 60.97 270 top
H11  PZ254V-11-02P  [HDR-TH_2P-P2.54-V-M]  112.14 51.18 270 top
H12  PZ254V-11-02P  [HDR-TH_2P-P2.54-V-M]  86.87 92.2 180 top
H13  PZ254V-11-02P  [HDR-TH_2P-P2.54-V-M]  3.94 19.18 270 top
H14  PZ254V-11-02P  [HDR-TH_2P-P2.54-V-M]  139.03 3.4 0 top
H15  PZ254V-11-02P  [HDR-TH_2P-P2.54-V-M]  2.79 82.04 90 top
H16  PZ254V-11-02P  [HDR-TH_2P-P2.54-V-M]  24.64 104.39 0 top
LED1  -  [LED_TH-3mm]  126.24 86.11 270 top
PR1  10K  [R_3386P]  124.21 109.47 90 top
PR2  10K  [R_3386P]  101.73 45.21 0 top
PR3  10K  [R_3386P]  92.33 7.75 0 top
Q1  2N2222A  [TO-92-3_L4.8-W3.7-P2.54-R]  14.86 111.38 0 top
Q2  2N3906  [TO-92-3_L4.9-W3.7-P1.27-L]  32.89 40.26 270 top
Q3  TIP42A  [TO-220-3_L10.2-W4.5-P2.54-L]  59.31 111.51 180 top
Q4  TIP42A  [TO-220-3_L10.2-W4.5-P2.54-L]  98.81 113.16 270 top
Q5  2N2222A  [TO-92-3_L4.8-W3.7-P2.54-R]  117.29 95.57 270 top
Q6  2N3906  [TO-92-3_L4.9-W3.7-P1.27-L]  35.18 5.33 270 top
Q7  2N2222A  [TO-92-3_L4.8-W3.7-P2.54-R]  86.11 22.35 0 top
Q8  MJF  [TO-92-3_L4.8-W3.7-P2.54-R]  60.14 61.3 90 top
R1  1k  [Res_1/8W]  15.49 117.09 0 top
R2  10r  [Res_1/8W]  47.62 113.16 270 top
R3  1K  [Res_1/8W]  41.91 40.26 0 top
R4  10kΩ  [Res_1/8W]  45.21 91.95 90 top
R5  100R  [Res_1/8W]  56.39 100.97 0 top
R6  100R  [Res_1/8W]  91.06 113.16 90 top
R7  62.5R  [Res_1/8W]  112.27 106.3 0 top
R8  50R  [Res_1/8W]  54.86 61.21 270 top
R9  200R  [Res_1/8W]  94.36 32.89 180 top
R10  8kΩ  [Res_1/8W]  120.14 52.2 90 top
R11  5KΩ  [Res_1/8W]  125.6 52.32 90 top
R14  1K  [Res_1/8W]  101.6 91.69 180 top
R15  300R  [Res_1/8W]  126.62 74.42 90 top
R16  1kΩ  [Res_1/8W]  39.37 9.02 0 top
R17  10kΩ  [Res_1/8W]  63.63 29.08 90 top
R18  10kΩ  [Res_1/8W]  103.76 21.21 180 top
R19  1kΩ  [Res_1/8W]  86.36 17.02 0 top
R20  10kΩ  [Res_1/8W]  94.49 20.57 90 top
R21  12kΩ  [Res_1/8W]  101.6 17.14 0 top
R22  5kΩ  [Res_1/8W]  112.39 24.38 90 top
R23  5kΩ  [Res_1/8W]  139.57 19.3 270 top
R24  200R  [Res_1/8W]  107.19 6.98 270 top
R25  6.8K  [Res_1/8W]  138.43 7.75 0 top
R26  6.2K  [Res_1/8W]  138.56 12.32 0 top
R27  5K  [Res_1/8W]  79.5 80.64 270 top
R28  5K  [Res_1/8W]  83.57 80.77 270 top
RELAY1  SRD-12VDC-SL-C  [RELAY-TH_SRD-XXVDC-XL-C]  10.92 96.77 270 top
RELAY2  SRD-12VDC-SL-C  [RELAY-TH_SRD-XXVDC-XL-C]  19.81 34.16 180 top
RELAY3  SRD-12VDC-SL-C  [RELAY-TH_SRD-XXVDC-XL-C]  111.38 80.26 0 top
RELAY4  SRD-12VDC-SL-C  [RELAY-TH_SRD-XXVDC-XL-C]  19.69 14.99 180 top
SW1  -  [Key_TH_3.5x6x4.3]  45.09 81.41 90 top
SW2  SS13D07VG4  [SW-TH_SS13D07VG4]  72.9 82.04 270 top
SW3  -  [Key_TH_3.5x6x4.3]  63.63 18.41 90 top
U1  LM324N  [DIP-14_L19.4-W6.4-P2.54-LS7.6-BL]  33.02 114.05 0 top
U2  LM7812T  [TO-220-3_L10.0-W4.5-P2.54-L]  59.82 118.24 180 top
U3  LM7805CT  [TO-220-3_L10.2-W4.6-P2.54-L]  105.03 113.28 270 top
U4  LM317L  [TO-92-3_L4.9-W3.7-P1.27-L]  113.54 111.51 90 top
U5  LM7912CT  [TO-220-3_L10.0-W4.6-P2.54-L]  69.6 61.21 270 top
U6  74LS74D  [74LS74]  57.15 87.63 90 top
U7  LM324N  [DIP-14_L19.4-W6.4-P2.54-LS7.6-BL]  57.91 75.31 0 top
U8  LM317T  [TO-220-3_L10.0-W4.6-P2.54-L]  88.39 47.5 180 top
U9  LM324N  [DIP-14_L19.4-W6.4-P2.54-LS7.6-BL]  93.09 79.76 270 top
U10  74LS74D  [74LS74]  73.53 23.75 0 top
U11  LM324N  [DIP-14_L19.4-W6.4-P2.54-LS7.6-BL]  130.56 24.76 90 top
U12  LM337K  [TO-220-3_L10.0-W4.6-P2.54-L]  78.49 7.75 90 top

## Footprints (pads in the part's own frame, mm; a bottom-side part is the same pattern mirrored in y, then rotated)
74LS74
  round 1.827 hole 0.787: 1(-4.112,7.319) 2(-4.112,4.779) 3(-4.112,2.239) 4(-4.112,-0.301) 5(-4.112,-2.841) 6(-4.112,-5.381) 7(-4.112,-7.921) 8(3.509,-7.921) 9(3.509,-5.381) 10(3.509,-2.841) 11(3.509,-0.301) 12(3.509,2.239) 13(3.509,4.779) 14(3.509,7.319)
CAP-TH_BD12.5-P5.00-D0.6-FD
  round 2.1 hole 1.2: 1(-2.5,0) 2(2.5,0)
CAP-TH_L5.5-W4.0-P5.00-D0.5
  round 1.6 hole 1: 1(-2.5,0) 2(2.5,0)
DIP-14_L19.4-W6.4-P2.54-LS7.6-BL
  rect 1.5x2 hole 1: 1(-7.62,-3.811)
  oval 1.5x2 hole 1: 2(-5.08,-3.811) 3(-2.54,-3.811) 4(0,-3.811) 5(2.54,-3.811) 6(5.08,-3.811) 7(7.62,-3.811) 8(7.62,3.811) 9(5.08,3.809) 10(2.54,3.809) 11(0,3.809) 12(-2.54,3.809) 13(-5.08,3.809) 14(-7.62,3.809)
DO-41_BD2.4-L4.7-P8.70-D0.9-RD
  round 1.8 hole 1: 1(-4.35,0) 2(4.35,0)
HDR-TH_2P-P2.54-V-M
  rect 2x2 hole 1.2: 1(-1.27,0)
  round 2 hole 1.2: 2(1.27,0)
Key_TH_3.5x6x4.3
  round 1.999 hole 1.399: A(-3.084,0) B(3.416,0)
LED_TH-3mm
  round 1.524 hole 0.914: 1(-1.27,0) 2(1.27,0)
R_3386P
  round 1.6 hole 1.001: 1(0,-2.54) 2(-2.54,0) 3(0,2.54)
RELAY-TH_SRD-XXVDC-XL-C
  round 2.794 hole 1.524: 1(-5.1,-6) 2(7.1,-6) 3(7.1,6) 4(-5.1,6) 5(-7.1,0)
Res_1/8W
  round 1.199 hole 0.8: 1(-3.599,0.063) 2(3.599,0.063)
SW-TH_SS13D07VG4
  round 1.4 hole 0.8: 1(-4,0) 2(0,0) 3(2,0) 4(4,0)
  oval 1.4x2.2 hole 0.8x1.6: 5(6.2,0) 6(-6.2,0)
TO-92-3_L4.8-W3.7-P2.54-R
  rect 1.8x1.8 hole 1: 1(2.54,0)
  round 1.8 hole 1: 2(0,0) 3(-2.54,0)
TO-92-3_L4.9-W3.7-P1.27-L
  rect 0.9x1.6 hole 0.7: 1(-1.27,0)
  oval 0.9x1.6 hole 0.7: 2(0,0) 3(1.27,0)
TO-220-3_L10.0-W4.5-P2.54-L
  rect 1.8x2.6 hole 1.2: 1(-2.54,0.005)
  oval 1.8x2.6 hole 1.2: 2(0,0.005) 3(2.54,-0.005)
TO-220-3_L10.0-W4.6-P2.54-L
  rect 1.9x2.4 hole 1.3: 1(-2.54,0)
  oval 1.9x2.4 hole 1.3: 2(0,0) 3(2.54,0)
TO-220-3_L10.2-W4.5-P2.54-L
  rect 1.8x1 hole 1.2x0.6: 1(-2.54,0)
  oval 1.8x1 hole 1.2x0.6: 2(0,0) 3(2.54,0)
TO-220-3_L10.2-W4.6-P2.54-L
  rect 2x1.5 hole 1.4x0.8: 1(-2.54,0)
  oval 2x1.5 hole 1.4x0.8: 2(0,0) 3(2.54,0)

## Nets
As in the schematic.

Pads without a net: RELAY1 3; RELAY2 3 4; RELAY3 3; RELAY4 3; SW2 5 6; U1 5 6 7 8 9 10 12 13 14; U6 6 7 8 9 10 11 12 13 14; U7 5 6 7 8 9 10 12 13 14; U9 5 6 7 8 9 10 12 13 14; U10 6 7 8 9 10 11 12 13 14; U11 5 6 7 8 9 10 12 13 14

## Via types
v1: diameter 0.61, hole 0.305, Top Layer to Bottom Layer, 418 vias

## Routing (per net, layer and track width the routed paths; a pad name or vN(x,y) marks a point on that pad's centre or on a via; arc(x,y) is an arc through that point)
GND:
  vias: v1(5.64,117.04) v1(5.64,111.96) v1(5.64,106.88) v1(5.64,91.64) v1(5.64,86.56) v1(5.64,76.4) v1(5.64,66.24) v1(5.64,61.16) v1(5.64,51) v1(5.64,45.92) v1(5.64,40.84) v1(5.64,30.68) v1(5.64,25.6) v1(5.64,15.44) v1(5.64,10.36) v1(5.64,5.28) v1(10.72,111.96) v1(10.72,96.72) v1(10.72,91.64) v1(10.72,86.56) v1(10.72,81.48) v1(10.72,71.32) v1(10.72,66.24) v1(10.72,61.16) v1(10.72,56.08) v1(10.72,51) v1(10.72,45.92) v1(10.72,40.84) v1(10.72,35.76) v1(10.72,30.68) v1(10.72,25.6) v1(10.72,15.44) v1(10.72,10.36) v1(10.72,5.28) v1(15.8,117.04) v1(15.8,96.72) v1(15.8,91.64) v1(15.8,86.56) v1(15.8,76.4) v1(15.8,71.32) v1(15.8,66.24) v1(15.8,51) v1(15.8,45.92) v1(15.8,40.84) v1(15.8,35.76) v1(15.8,30.68) v1(15.8,25.6) v1(15.8,20.52) v1(15.8,15.44) v1(15.8,10.36) v1(15.8,5.28) v1(20.88,111.96) v1(20.88,101.8) v1(20.88,96.72) v1(20.88,76.4) v1(20.88,66.24) v1(20.88,51) v1(20.88,45.92) v1(20.88,40.84) v1(20.88,35.76) v1(20.88,25.6) v1(20.88,20.52) v1(20.88,15.44) v1(20.88,10.36) v1(20.88,5.28) v1(25.96,101.8) v1(25.96,96.72) v1(25.96,81.48) v1(25.96,76.4) v1(25.96,71.32) v1(25.96,61.16) v1(25.96,56.08) v1(25.96,45.92) v1(25.96,25.6) v1(25.96,5.28) v1(31.04,111.96) v1(31.04,101.8) v1(31.04,96.72) v1(31.04,91.64) v1(31.04,86.56) v1(31.04,81.48) v1(31.04,76.4) v1(31.04,71.32) v1(31.04,66.24) v1(31.04,51) v1(31.04,45.92) v1(31.04,40.84) v1(31.04,35.76) v1(31.04,25.6) v1(31.04,20.52) v1(31.04,5.28) v1(36.12,111.96) v1(36.12,91.64) v1(36.12,86.56) v1(36.12,71.32) v1(36.12,66.24) v1(36.12,61.16) v1(36.12,56.08) v1(36.12,51) v1(36.12,35.76) v1(36.12,25.6) v1(36.12,20.52) v1(36.12,10.36) v1(41.2,111.96) v1(41.2,96.72) v1(41.2,91.64) v1(41.2,86.56) v1(41.2,81.48) v1(41.2,76.4) v1(41.2,71.32) v1(41.2,61.16) v1(41.2,56.08) v1(41.2,51) v1(41.2,45.92) v1(41.2,40.84) v1(41.2,25.6) v1(41.2,20.52) v1(41.2,15.44) v1(41.2,10.36) v1(41.2,5.28) v1(46.28,117.04) v1(46.28,111.96) v1(46.28,96.72) v1(46.28,91.64) v1(46.28,86.56) v1(46.28,81.48) v1(46.28,76.4) v1(46.28,71.32) v1(46.28,61.16) v1(46.28,56.08) v1(46.28,25.6) v1(46.28,20.52) v1(46.28,15.44) v1(46.28,10.36) v1(46.28,5.28) v1(51.36,117.04) v1(51.36,111.96) v1(51.36,106.88) v1(51.36,96.72) v1(51.36,76.4) v1(51.36,66.24) v1(51.36,51) v1(51.36,45.92) v1(51.36,40.84) v1(51.36,25.6) v1(56.44,101.8) v1(56.44,96.72) v1(56.44,86.56) v1(56.44,81.48) v1(56.44,66.24) v1(56.44,56.08) v1(56.44,51) v1(56.44,40.84) v1(56.44,25.6) v1(56.44,10.36) v1(61.52,96.72) v1(61.52,86.56) v1(61.52,76.4) v1(61.52,56.08) v1(61.52,51) v1(61.52,40.84) v1(61.52,30.68) v1(61.52,25.6) v1(61.52,20.52) v1(61.52,15.44) v1(61.52,10.36) v1(61.52,5.28) v1(66.6,117.04) v1(66.6,111.96) v1(66.6,101.8) v1(66.6,96.72) v1(66.6,91.64) v1(66.6,86.56) v1(66.6,76.4) v1(66.6,56.08) v1(66.6,51) v1(66.6,40.84) v1(66.6,35.76) v1(66.6,25.6) v1(66.6,20.52) v1(66.6,15.44) v1(66.6,10.36) v1(66.6,5.28) v1(71.68,117.04) v1(71.68,106.88) v1(71.68,96.72) v1(71.68,91.64) v1(71.68,71.32) v1(71.68,66.24) v1(71.68,61.16) v1(71.68,51) v1(71.68,40.84) v1(71.68,35.76) v1(71.68,20.52) v1(71.68,15.44) v1(71.68,10.36) v1(71.68,5.28) v1(76.76,117.04) v1(76.76,106.88) v1(76.76,96.72) v1(76.76,91.64) v1(76.76,81.48) v1(76.76,76.4) v1(76.76,71.32) v1(76.76,66.24) v1(76.76,61.16) v1(76.76,51) v1(76.76,40.84) v1(81.84,117.04) v1(81.84,111.96) v1(81.84,106.88) v1(81.84,101.8) v1(81.84,96.72) v1(81.84,91.64) v1(81.84,81.48) v1(81.84,71.32) v1(81.84,66.24) v1(81.84,56.08) v1(81.84,51) v1(81.84,40.84) v1(81.84,35.76) v1(81.84,25.6) v1(81.84,20.52) v1(81.84,15.44) v1(81.84,10.36) v1(86.92,117.04) v1(86.92,111.96) v1(86.92,106.88) v1(86.92,101.8) v1(86.92,96.72) v1(86.92,86.56) v1(86.92,76.4) v1(86.92,71.32) v1(86.92,66.24) v1(86.92,56.08) v1(86.92,51) v1(86.92,45.92) v1(86.92,40.84) v1(86.92,35.76) v1(86.92,30.68) v1(86.92,15.44) v1(86.92,10.36) v1(86.92,5.28) v1(92,111.96) v1(92,106.88) v1(92,101.8) v1(92,91.64) v1(92,81.48) v1(92,51) v1(92,35.76) v1(92,30.68) v1(92,15.44) v1(97.08,111.96) v1(97.08,106.88) v1(97.08,96.72) v1(97.08,66.24) v1(97.08,56.08) v1(97.08,51) v1(97.08,35.76) v1(97.08,30.68) v1(97.08,15.44) v1(97.08,10.36) v1(102.16,117.04) v1(102.16,106.88) v1(102.16,96.72) v1(102.16,91.64) v1(102.16,86.56) v1(102.16,81.48) v1(102.16,76.4) v1(102.16,71.32) v1(102.16,66.24) v1(102.16,56.08) v1(102.16,51) v1(102.16,45.92) v1(102.16,35.76) v1(102.16,30.68) v1(102.16,25.6) v1(102.16,20.52) v1(102.16,15.44) v1(107.24,117.04) v1(107.24,106.88) v1(107.24,96.72) v1(107.24,91.64) v1(107.24,81.48) v1(107.24,76.4) v1(107.24,71.32) v1(107.24,66.24) v1(107.24,45.92) v1(107.24,35.76) v1(107.24,30.68) v1(107.24,25.6) v1(107.24,15.44) v1(107.24,5.28) v1(112.32,117.04) v1(112.32,106.88) v1(112.32,101.8) v1(112.32,96.72) v1(112.32,91.64) v1(112.32,71.32) v1(112.32,66.24) v1(112.32,61.16) v1(112.32,56.08) v1(112.32,25.6) v1(112.32,15.44) v1(112.32,5.28) v1(117.4,117.04) v1(117.4,111.96) v1(117.4,106.88) v1(117.4,101.8) v1(117.4,81.48) v1(117.4,76.4) v1(117.4,71.32) v1(117.4,66.24) v1(117.4,61.16) v1(117.4,56.08) v1(117.4,45.92) v1(117.4,40.84) v1(117.4,35.76) v1(117.4,30.68) v1(117.4,25.6) v1(117.4,15.44) v1(122.48,111.96) v1(122.48,106.88) v1(122.48,101.8) v1(122.48,96.72) v1(122.48,91.64) v1(122.48,86.56) v1(122.48,76.4) v1(122.48,71.32) v1(122.48,66.24) v1(122.48,61.16) v1(122.48,51) v1(122.48,45.92) v1(122.48,40.84) v1(122.48,35.76) v1(122.48,30.68) v1(122.48,20.52) v1(122.48,15.44) v1(122.48,10.36) v1(127.56,117.04) v1(127.56,111.96) v1(127.56,106.88) v1(127.56,101.8) v1(127.56,96.72) v1(127.56,91.64) v1(127.56,86.56) v1(127.56,81.48) v1(127.56,76.4) v1(127.56,66.24) v1(127.56,61.16) v1(127.56,56.08) v1(127.56,51) v1(127.56,45.92) v1(127.56,40.84) v1(127.56,35.76) v1(132.64,117.04) v1(132.64,111.96) v1(132.64,106.88) v1(132.64,101.8) v1(132.64,96.72) v1(132.64,91.64) v1(132.64,86.56) v1(132.64,81.48) v1(132.64,76.4) v1(132.64,71.32) v1(132.64,66.24) v1(132.64,61.16) v1(132.64,15.44) v1(132.64,10.36) v1(137.72,117.04) v1(137.72,111.96) v1(137.72,106.88) v1(137.72,101.8) v1(137.72,96.72) v1(137.72,91.64) v1(137.72,86.56) v1(137.72,81.48) v1(137.72,76.4) v1(137.72,71.32) v1(137.72,66.24) v1(137.72,61.16) v1(137.72,56.08) v1(137.72,51) v1(137.72,45.92) v1(137.72,40.84) v1(137.72,35.76) v1(137.72,30.68) v1(137.72,25.6) v1(137.72,15.44) v1(137.72,10.36) v1(142.8,117.04) v1(142.8,111.96) v1(142.8,106.88) v1(142.8,101.8) v1(142.8,96.72) v1(142.8,91.64) v1(142.8,86.56) v1(142.8,81.48) v1(142.8,76.4) v1(142.8,71.32) v1(142.8,66.24) v1(142.8,61.16) v1(142.8,56.08) v1(142.8,51) v1(142.8,45.92) v1(142.8,40.84) v1(142.8,35.76) v1(142.8,30.68) v1(142.8,25.6) v1(142.8,20.52) v1(142.8,5.28)
$1N8527: length 7
  Top Layer w0.508: R1.1 14.86,114.19 Q1.2
$1N8531: length 11.3
  Bottom Layer w0.508: R1.2 22.16,117.16 25.4,113.92 U1.1
$1N8534: length 9.7
  Top Layer w0.508: 17.4,111.38 17.4,102.35 16.92,101.87
$1N8562: length 23.5
  Top Layer w0.508: U1.3 30.48,108.71 35.81,103.38 H1.1
  Top Layer w1.016: R2.2 45.19,107.06 40.13,107.06 H1.1
$1N8572: length 6.9
  Top Layer w1.016: H2.1 39.13,103.24 H1.2
$1N8662: length 25.3
  Top Layer w2: 10.92,103.87 10.92,100.34 3.93,93.34 3.43,93.34 1.52,91.44 1.52,84.58 H15.2
$1N8666: length 4.7
  Top Layer w2: H3.2 2.86,80.71 H15.1
$1N8670: length 7.5
  Top Layer w2: H3.1 7.51,87.09 4.92,89.67
$1N8706: length 14.5
  Top Layer w1.016: 105.03,115.82 104.9,115.7 Q4.1 97.75,116.76 R6.2
$1N8820: length 39.9
  Bottom Layer w1.016: H4.1 20.75,87.79 D3.1 21.59,91.28 D1.2 23.5,93.44 23.5,104.27 H16.1
$1N8830: length 47.5
  Bottom Layer w1.016: H16.2 27.81,102.49 27.81,93.06 D2.2 26.21,90.34 D4.1 18.76,80.39 16.89,80.39 8.89,72.39 8.89,70.74 8.19,70.04 H4.2
$1N8864: length 63
  Top Layer w1.016: 52.79,101.03 39.6,101.03 C1.1 31.42,99.6 D2.1 25.15,100.11 D1.1
  Bottom Layer w1.016: C1.1 37.85,93.18 37.85,85.3 C2.1 ; 56.77,111.51 56.77,105.01 52.79,101.03
$1N8887: length 18.2
  Top Layer w1.016: Q3.1 62.36,112.01 62.36,118.23
  Bottom Layer w1.016: Q3.1 61.85,102.89 R5.2
$1N9273: length 8.3
  Top Layer w1.016: 113.38,111.51 113.22,111.67 111.79,111.67 109.98,109.85 109.98,107.67 R7.1
$1N9281: length 14
  Top Layer w1.016: 113.54,110.24 120.9,110.24 PR1.3
  Bottom Layer w1.016: R7.2 115.7,106.53 115.7,109.22 114.68,110.24 113.54,110.24
$1N9296: length 13.7
  Bottom Layer w1.016: PR1.2 PR1.1 125.73,109.47 124.08,111.12 124.08,114.16 123.25,115 H9.1
$1N9332: length 15.1
  Top Layer w1.016: H5.1 13.25,59.05 D5.2
  Bottom Layer w1.016: D7.1 D5.2
$1N9341: length 23.5
  Top Layer w1.016: H5.2 7.49,56.52 10.67,53.34 17.67,53.34 D8.1
  Bottom Layer w1.016: D8.1 D6.2
$1N9352: length 33
  Top Layer w1.016: C4.1 C3.1 28.63,62.44 D6.1 20.5,69.3 D5.1
$1N9450: length 16.2
  Top Layer w1.016: U5.2 69.51,61.3 Q8.2 56.45,57.61 R8.2
$1N9461: length 53.4
  Top Layer w1.016: Q8.1 59.17,64.81 R8.1 51.05,60.94 51.05,60.2 48.3,57.44 C4.2 C3.2 22.03,48.1 D8.2 20.5,47.47 D7.2
$1N9538: length 10.6
  Top Layer w1.016: H6.1 8.24,35.69 RELAY2.2
$1N9559: length 14.7
  Top Layer w1.016: D9.2 34.39,34.16 RELAY2.5
  Bottom Layer w1.016: D11.1 35.53,28.45 D9.2
$1N9564: length 60.7
  Top Layer w1.016: H6.2 17.91,33.15 19.94,31.12 45.72,31.12 46.86,29.97 55.02,29.97 D10.2
  Bottom Layer w1.016: D10.2 D12.1
$1N9660: length 62.4
  Top Layer w1.016: C5.1 57.06,46.48 66.33,46.48 C6.1 ; 65.91,46.86 85.22,46.86 U8.3 ; D9.1 48.36,33.02 48.86,32.51
  Bottom Layer w1.016: U8.3 85.85,44.23 D13.1 ; 48.86,32.51 53.76,37.41 C5.1
$1N9701: length 12.8
  Top Layer w1.016: 101.73,42.67 PR2.2 98.93,45.47 96.01,45.47 93.98,47.5 U8.1
$1N9726: length 12
  Top Layer w1.016: C13.2 104.42,32.83 97.96,32.83
  Bottom Layer w1.016: D14.2 98.96,34.58 98.04,33.66 ; 98.04,33.66 97.92,33.53 ; 98.04,33.66 98.04,32.91 97.96,32.83 ; 98.04,33.66 98.04,33.91
$1N9822: length 66.5
  Top Layer w1.016: C15.1 119.34,40.98 116.42,38.06 C14.2 108.04,40.13 100.58,40.13 98.93,41.78 D13.2 ; 120.08,48.6 116.23,52.45 H11.1
  Bottom Layer w1.016: 120.08,48.6 120.08,41.05 C15.1 ; 90.76,32.83 90.27,33.33 D14.1 92.11,39.05 D13.2 91.6,42.29 89.03,42.29 88.39,42.93 U8.2
$1N9845: length 8.8
  Top Layer w1.016: RELAY2.1 27.02,40.16 28.58,38.61 32.51,38.61 Q2.3
$1N9860: length 5.4
  Top Layer w1.016: 38.31,40.32 38.25,40.26 Q2.2
$1N9863: length 62.5
  Bottom Layer w1.016: U6.5 59.99,82.12 60.58,81.53 66.67,81.53 68.2,80.01 68.2,70.36 64.14,66.29 59.05,66.29 56.77,64.01 56.77,62.1 45.51,50.84 45.51,40.32
$1N9870: length 8.8
  Top Layer w1.016: U6.1 48.53,84.82 SW1.B
  Bottom Layer w1.016: R4.1 45.15,84.89 SW1.B
$1N9927: length 18.3
  Bottom Layer w1.016: U7.1 50.29,73.15 47.75,75.69 47.75,79.76 49.53,81.53 53.47,81.53 54.91,82.98 U6.3
$1N10006: length 88.9
  Top Layer w1.016: R11.2 125.41,55.8 120.08,55.8 ; U7.3 58.67,68.2 124.84,68.2 v1(125.1,67.94)
  Bottom Layer w1.016: v1(125.1,67.94) 125.1,56.37 R11.2
$1N10325: length 32.7
  Top Layer w1.016: R23.1 136.42,19.69 U11.2 132.97,19.69 128.65,15.37 124.59,15.37 119.17,20.78 R22.1
$1N10603: length 11.9
  Top Layer w1.016: 79.57,77.05 83.5,77.05 R28.2 88.75,82.3 U9.3
$1N10668: length 62.2
  Top Layer w1.016: 80.64,87.38 84.07,87.38 86.61,84.84 U9.2 ; SW2.1 79.44,86.04 80.64,87.25
  Bottom Layer w1.016: 91.35,84.84 94.11,82.08 94.11,71.12 95.38,69.85 98.81,69.85 100.33,71.37 100.33,76.31 RELAY3.5 ; 91.35,84.84 91.69,84.84 91.95,85.09 91.95,88.39 H12.1 ; 91.35,84.84 U9.2
$1N10682: length 17.1
  Bottom Layer w1.016: LED1.1 125.22,87.38 122.3,84.45 122.3,77.72 118.84,74.26 RELAY3.2
$1N10687: length 25
  Bottom Layer w1.016: RELAY3.1 109.06,74.26 111.63,76.83 111.63,87.37 Q5.1
$1N10691: length 20.9
  Top Layer w1.016: Q5.2 116.84,95.12 101.49,95.12 R14.2
$1N10694: length 17.7
  Top Layer w1.016: U9.1 93.73,87.38 95.76,89.41 102.98,89.41 R14.1
$1N10806: length 210.5
  Top Layer w1.016: v1(131.83,58.42) 112.78,58.42 107.32,52.96 91.54,52.96 91.54,52.93 v1(91.5,52.9) ; SW2.3 77.25,80.04 79.57,82.36 79.57,84.24 ; U2.3 57.28,115.19 59.31,113.16 Q3.2 59.31,109.73 61.21,107.82 66.55,107.82 H7.1 77.89,112.14 C7.1 90.02,110.53 R6.1 97.75,109.56 Q4.3
  Bottom Layer w1.016: U11.4 132.46,24.76 131.83,25.4 v1(131.83,58.42) ; C7.1 79.5,103.67 C8.1 79.57,97.43 79.57,82.11 81.92,79.76 U9.4 89.92,79.76 91.31,78.36 91.31,53.09
$1N10899: length 6.9
  Bottom Layer w1.016: LED1.2 126.56,84.52 R15.2
$1N10928: length 8.9
  Top Layer w1.016: H13.1 12.05,20.45 RELAY4.2
$1N10938: length 62.1
  Top Layer w1.016: H13.2 32.26,17.91 33.53,19.18 55.28,19.18 D19.1
  Bottom Layer w1.016: D17.2 58.83,21.21 D19.1
$1N10984: length 21.9
  Bottom Layer w1.016: RELAY4.1 31.5,14.28 31.5,6.6 34.04,4.06 Q6.3
$1N11025: length 7.6
  Bottom Layer w1.016: R16.1 36.21,8.64 37.59,8.64 37.85,8.38 37.85,6.1 37.08,5.33 Q6.2
$1N11032: length 31.4
  Top Layer w1.016: U10.5 67.31,18.8 58.29,18.8 48.58,9.08 R16.2
$1N11038: length 11.9
  Bottom Layer w1.016: SW3.B 63.63,25.42 R17.1 69.15,31.07 U10.1
$1N11076: length 41.6
  Top Layer w1.016: D15.1 88.45,26.48 79.38,35.56 75.57,35.56 72.77,32.77 72.77,27.31 71.45,25.99 U10.3
$1N11079: length 118.2
  Top Layer w1.016: 100.16,21.15 94.3,21.15 ; 94.3,21.15 94.42,21.02 ; 94.3,21.15 90.8,24.64 86.87,24.64 78.49,33.02 76.33,33.02 75.06,31.75 ; 74.93,31.62 74.93,26.16 72.22,23.45 U10.4 ; U10.2 67.72,28.53 R17.2 59.54,36.7 v1(38.61,36.7)
  Bottom Layer w1.016: Q6.1 33.78,8 33.78,11.43 38.48,16.13 38.48,36.58 v1(38.61,36.7) ; U10.2 69.5,28.45 70.61,28.45 72.14,26.92 72.14,25.27 70.31,23.45 U10.4
$1N11096: length 26.7
  Top Layer w1.016: 107.36,21.15 105.52,19.3 93.6,19.3 90.55,22.35 Q7.1
  Bottom Layer w1.016: 107.36,21.15 108.81,22.6 D15.2
$1N11127: length 6.7
  Bottom Layer w1.016: R19.1 86.11,20.43 Q7.2
$1N11133: length 8.2
  Top Layer w1.016: 98,17.21 97.77,16.97 R20.1 94.32,17.08 R19.2
$1N11145: length 3.6
  Top Layer w1.016: 105.2,17.21 108.36,17.21 D16.1
$1N11175: length 21.3
  Top Layer w1.016: U11.1 134.37,14.73 133.48,13.84 121.79,13.84 118.11,17.53 D16.2
$1N11189: length 20.9
  Top Layer w1.016: 142.37,13.21 142.03,12.87 142.03,7.81
  Bottom Layer w1.016: R26.2 142.16,18.37 138.3,22.22 U11.3
$1N11389: length 14.2
  Top Layer w1.016: RELAY4.5 33.62,14.99 D18.2
  Bottom Layer w1.016: D18.2 34.89,16.51 D20.1
$1N11436: length 69.8
  Top Layer w1.016: 65.92,7.97 70.26,12.35 D22.2 ; 65.92,7.97 C17.1 61.64,9.02 53,9.02 C16.1 ; 65.92,7.97 66.21,8.25 ; D20.2 49.12,21.72 D19.2
  Bottom Layer w1.016: D22.2 80.55,12.35 U12.3 ; D19.2 53.47,17.88 53.47,9.48 C16.1
$1N11615: length 68.8
  Top Layer w1.016: U12.2 82.42,7.75 83.82,6.35 83.82,3.91 D22.1 ; H14.1 137.76,4.88 R25.1 131.76,4.74 C20.1 127.25,4.61 C19.2 115.5,2.76 D21.1 111.14,3.39 R24.2 105.77,1.91 v1(90.93,1.91)
  Bottom Layer w1.016: v1(90.93,1.91) 89.19,3.65 D22.1
$1N11653: length 42.7
  Top Layer w1.016: U12.1 81.41,2.29 81.41,1.91 86.87,1.91 89.79,4.83 PR3.2 PR3.1 101.94,5.21 C18.2 107.25,10.52 107.25,10.58 110.88,10.58 D21.2
$1N11660: length 126.3
  Top Layer w1.016: Q8.3 66.84,58.76 ; 66.84,58.76 71.25,54.36 76.93,54.36 C11.2 81.36,58.33 C12.2 105.17,58.33 H10.2 ; 66.84,58.76 66.67,58.93 ; R22.2 119.85,27.98 123.06,24.76 U11.11
  Bottom Layer w1.016: SW2.4 72.71,77.85 70.99,77.85 69.98,76.83 69.98,68.6 Q8.3 ; R22.2 112.33,45.27 106.54,51.07 H10.2
$1N11678: length 39.5
  Top Layer w1.016: U5.3 76.25,58.67 C11.1 95.4,63.56 C12.1 105.45,63.33 H10.1
$1N11708: length 263.4
  Top Layer w1.016: U4.3 113.16,113.16 109.6,113.16 107.19,110.74 U3.3 104.77,111 103.63,111 101.47,113.16 Q4.2 ; C10.1 108.71,99.06 106.05,101.73 96.86,101.73 C9.1 90.26,95.12 70.1,95.12 v1(69.98,95.25) ; U7.11 60.2,81.41 72.26,81.41 SW2.2 ; v1(37.08,67.06) 48.39,67.06 48.49,67.16 50,67.16 52.83,69.99 U7.2 ; U6.4 55.63,85.34 54.2,85.34 U6.2
  Bottom Layer w1.016: SW2.2 69.98,84.96 v1(69.98,95.25) ; U3.3 105.03,104.39 109.82,99.61 C10.1 109.82,89.8 RELAY3.4 ; H8.1 115.3,114.54 U4.3 ; 28.83,107.31 27.94,108.2 U1.2 ; U6.2 52.37,84.53 50.17,86.74 49.78,86.74 47.5,89.03 47.5,93.2 R4.2 43.31,97.39 43.31,103.12 40.13,106.3 35.94,106.3 33.02,109.22 ; 31.37,107.44 33.02,109.09 33.02,109.22 ; U1.4 33.02,109.22 ; U6.4 57.91,83.06 U7.11 57.91,76.83 52.83,71.75 U7.2 ; 31.12,107.19 10.24,107.19 4.92,101.87 ; v1(37.08,67.06) 37.72,66.42 37.72,46.35 Q2.1

## Copper pours and planes (outline as drawn; the poured copper is in the pictures)
GND on Top Layer: 0.76,121.41 143.64,121.41 143.64,0.89 0.76,0.89
GND on Bottom Layer: 0,121.31 143,121.31 143,0.63 0,0.63

## Text on the board
Top Silkscreen Layer: VAC1 | 变压器OUT3 | 变压器OUT4 | 变压器OUT1 | 变压器OUT2 | 变压器IN
